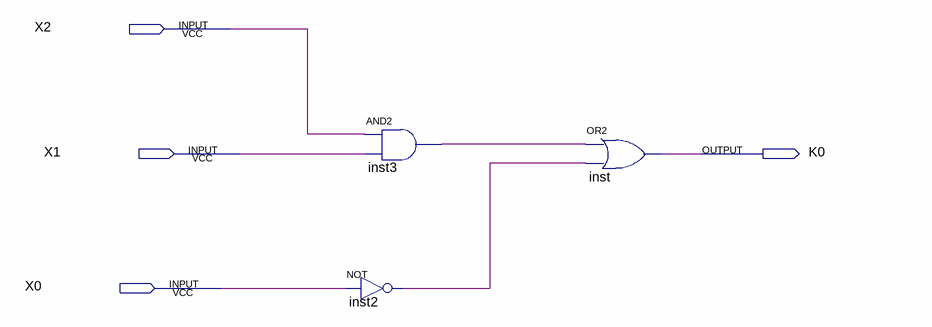
[diagram p0: schematic sheet]
// Quartus schematic K0.bdf as structural Verilog: 3 symbols, 4 pins
module K0 (
  input  X2,
  input  X1,
  input  X0,
  output K0
);

  wire inst2_out, inst3_out;

  and inst3 (inst3_out, X2, X1);
  not inst2 (inst2_out, X0);
  or inst (K0, inst3_out, inst2_out);
endmodule
